# Altium schematic sheet BrushedESC.SchDoc
size A
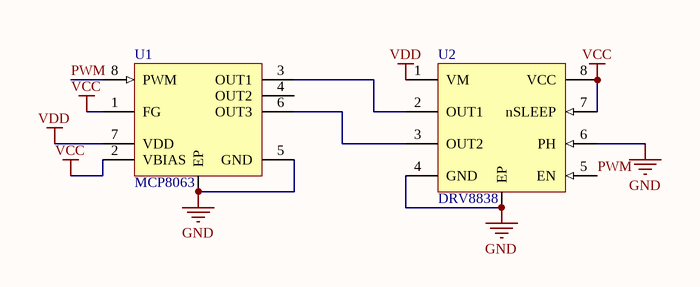
[diagram p0: BrushedESC.SchDoc]

## Parts
U1  MCP8063  [DFN8]
U2  DRV8838  [SON50P200X80_HS-9N]

## Nets
GND: U1.5(GND) U1.9(EP) U2.4(GND) U2.6(PH) U2.9(EP)
VCC: U1.1(FG) U1.2(VBIAS) U2.7(nSLEEP) U2.8(VCC)
VDD: U1.7(VDD) U2.1(VM)
PWM: U1.8(PWM) U2.5(EN)
NetU1_3: U1.3(OUT1) U2.2(OUT1)
NetU1_6: U1.6(OUT3) U2.3(OUT2)

Not connected (* = marked no-connect by the designer): U1 4(OUT2)

## Library data of the parts
U1 = MCP8063: 3-Phase Brushless DC Sinusoidal Sensorless Fan Motor Driver, MOSFET Output, 2 to 14 V, 8-pin SOP (SE8), Tube; PartNumber: MTD6501G-HC1; Manufacturer: Microchip; DatasheetVersion: Rev. B; ComponentLink1Description: Manufacturer URL; PackageDescription: 8-Lead Thermally Enhanced Plastic Small Outline, 4.9 x 3.9 mm Body, 1.27 mm Pitch; ComponentLink1URL: http://www.microchip.com; ComponentLink4URL: http://www.microchip.com/MTD6501G; ComponentLink3URL: http://www.microchip.com/stellent/groups/techpub_sg/documents/packagingspec/en012702.pdf; PackageVersion: C04-121A; ComponentLink2URL: http://ww1.microchip.com/downloads/en/DeviceDoc/22263B.pdf; ComponentLink2Description: Datasheet; ComponentLink3Description: Package Specification; PackageReference: SOP-SE8; Mounting Technology: Surface Mount; ComponentLink4Description: Product URL
U2 = DRV8838: 3-Phase Brushless DC Sinusoidal Sensorless Fan Motor Driver, MOSFET Output, 2 to 14 V, 8-pin SOP (SE8), Tube; PartNumber: MTD6501G-HC1; Manufacturer: Microchip; DatasheetVersion: Rev. B; ComponentLink1Description: Manufacturer URL; PackageDescription: 8-Lead Thermally Enhanced Plastic Small Outline, 4.9 x 3.9 mm Body, 1.27 mm Pitch; ComponentLink1URL: http://www.microchip.com; ComponentLink4URL: http://www.microchip.com/MTD6501G; ComponentLink3URL: http://www.microchip.com/stellent/groups/techpub_sg/documents/packagingspec/en012702.pdf; PackageVersion: C04-121A; ComponentLink2URL: http://ww1.microchip.com/downloads/en/DeviceDoc/22263B.pdf; ComponentLink2Description: Datasheet; ComponentLink3Description: Package Specification; PackageReference: SOP-SE8; Mounting Technology: Surface Mount; ComponentLink4Description: Product URL